# Altium schematic sheet CUBE+SCHEMATIC.schdoc
size 297 x 220 mm
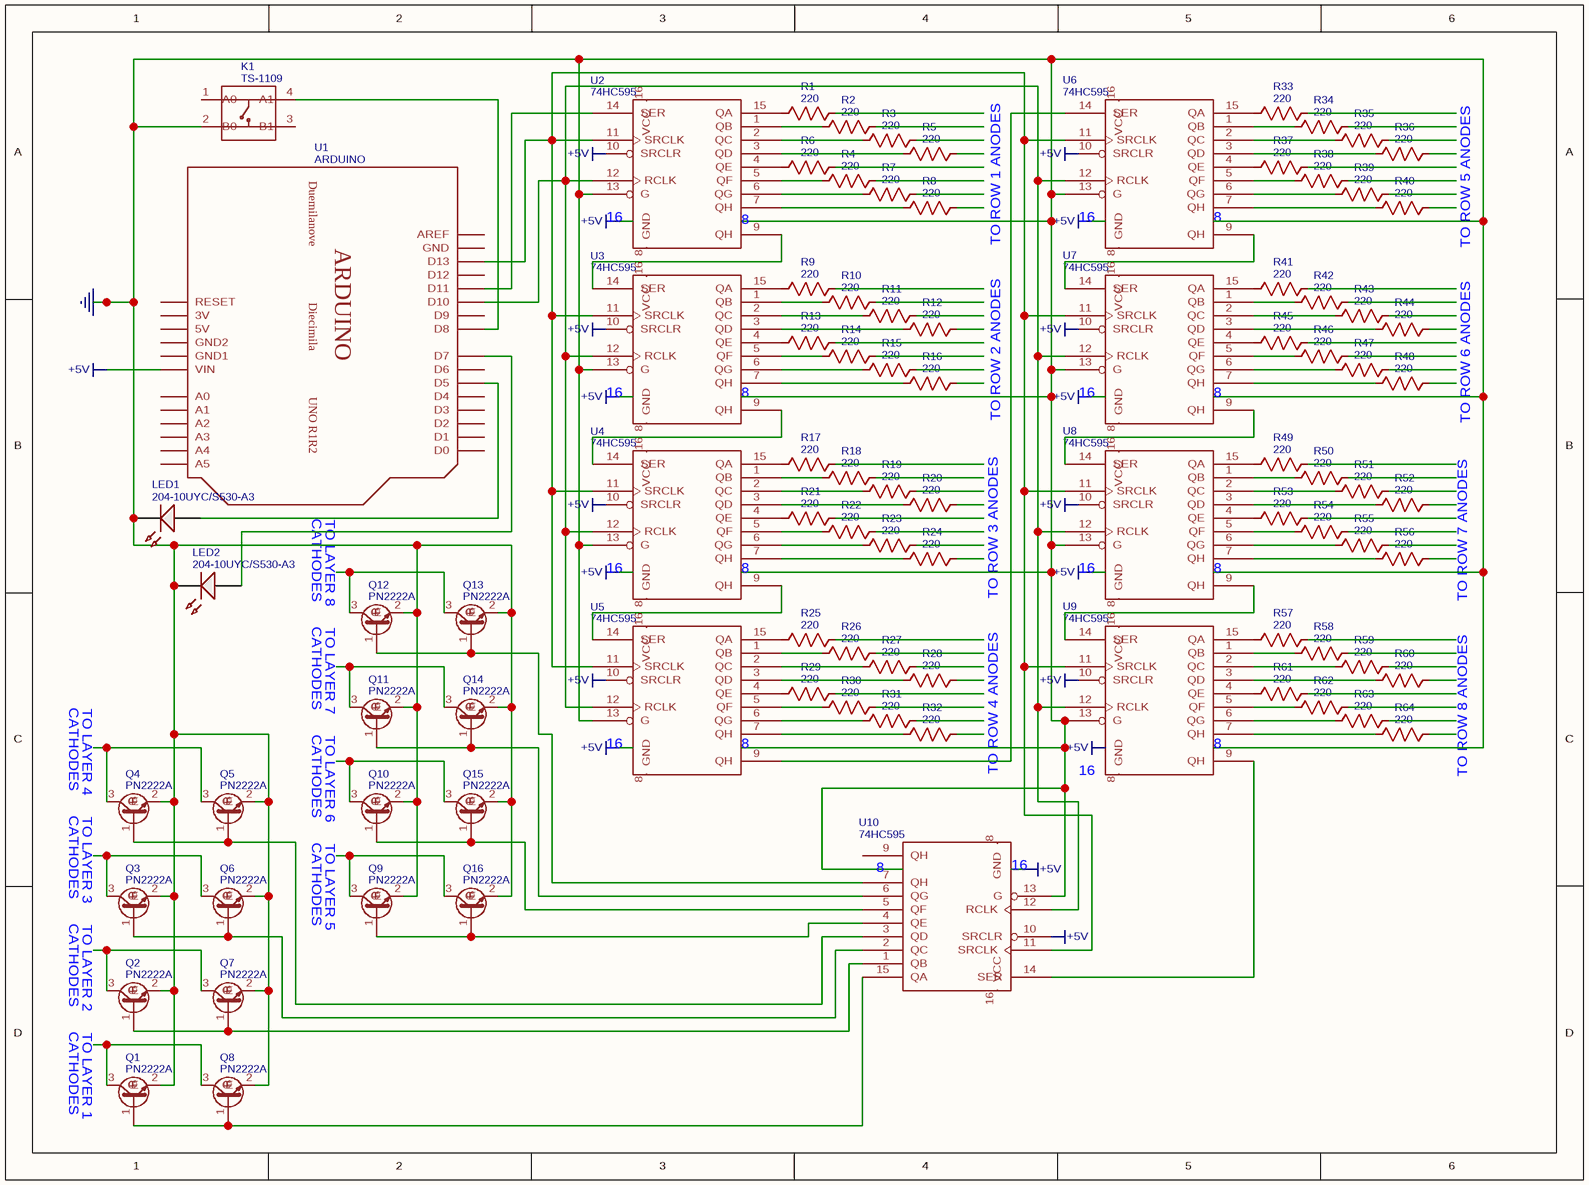
[diagram p0: CUBE+SCHEMATIC.schdoc]

## Parts
K1  value TS-1109  [SW4-6.0X6.0X5.0MM]
LED1  value 204-10UYC/S530-A3  [LED-3MM/2.54]
LED2  value 204-10UYC/S530-A3  [LED-3MM/2.54]
Q1  value PN2222A  [TO92]
Q2  value PN2222A  [TO92]
Q3  value PN2222A  [TO92]
Q4  value PN2222A  [TO92]
Q5  value PN2222A  [TO92]
Q6  value PN2222A  [TO92]
Q7  value PN2222A  [TO92]
Q8  value PN2222A  [TO92]
Q9  value PN2222A  [TO92]
Q10  value PN2222A  [TO92]
Q11  value PN2222A  [TO92]
Q12  value PN2222A  [TO92]
Q13  value PN2222A  [TO92]
Q14  value PN2222A  [TO92]
Q15  value PN2222A  [TO92]
Q16  value PN2222A  [TO92]
R1  value 220  [AXIAL-0.3]
R2  value 220  [AXIAL-0.3]
R3  value 220  [AXIAL-0.3]
R4  value 220  [AXIAL-0.3]
R5  value 220  [AXIAL-0.3]
R6  value 220  [AXIAL-0.3]
R7  value 220  [AXIAL-0.3]
R8  value 220  [AXIAL-0.3]
R9  value 220  [AXIAL-0.3]
R10  value 220  [AXIAL-0.3]
R11  value 220  [AXIAL-0.3]
R12  value 220  [AXIAL-0.3]
R13  value 220  [AXIAL-0.3]
R14  value 220  [AXIAL-0.3]
R15  value 220  [AXIAL-0.3]
R16  value 220  [AXIAL-0.3]
R17  value 220  [AXIAL-0.3]
R18  value 220  [AXIAL-0.3]
R19  value 220  [AXIAL-0.3]
R20  value 220  [AXIAL-0.3]
R21  value 220  [AXIAL-0.3]
R22  value 220  [AXIAL-0.3]
R23  value 220  [AXIAL-0.3]
R24  value 220  [AXIAL-0.3]
R25  value 220  [AXIAL-0.3]
R26  value 220  [AXIAL-0.3]
R27  value 220  [AXIAL-0.3]
R28  value 220  [AXIAL-0.3]
R29  value 220  [AXIAL-0.3]
R30  value 220  [AXIAL-0.3]
R31  value 220  [AXIAL-0.3]
R32  value 220  [AXIAL-0.3]
R33  value 220  [AXIAL-0.3]
R34  value 220  [AXIAL-0.3]
R35  value 220  [AXIAL-0.3]
R36  value 220  [AXIAL-0.3]
R37  value 220  [AXIAL-0.3]
R38  value 220  [AXIAL-0.3]
R39  value 220  [AXIAL-0.3]
R40  value 220  [AXIAL-0.3]
R41  value 220  [AXIAL-0.3]
R42  value 220  [AXIAL-0.3]
R43  value 220  [AXIAL-0.3]
R44  value 220  [AXIAL-0.3]
R45  value 220  [AXIAL-0.3]
R46  value 220  [AXIAL-0.3]
R47  value 220  [AXIAL-0.3]
R48  value 220  [AXIAL-0.3]
R49  value 220  [AXIAL-0.3]
R50  value 220  [AXIAL-0.3]
R51  value 220  [AXIAL-0.3]
R52  value 220  [AXIAL-0.3]
R53  value 220  [AXIAL-0.3]
R54  value 220  [AXIAL-0.3]
R55  value 220  [AXIAL-0.3]
R56  value 220  [AXIAL-0.3]
R57  value 220  [AXIAL-0.3]
R58  value 220  [AXIAL-0.3]
R59  value 220  [AXIAL-0.3]
R60  value 220  [AXIAL-0.3]
R61  value 220  [AXIAL-0.3]
R62  value 220  [AXIAL-0.3]
R63  value 220  [AXIAL-0.3]
R64  value 220  [AXIAL-0.3]
U1  value ARDUINO  [ARDUINO]
U2  value 74HC595  [NONE]
U3  value 74HC595  [NONE]
U4  value 74HC595  [NONE]
U5  value 74HC595  [NONE]
U6  value 74HC595  [NONE]
U7  value 74HC595  [NONE]
U8  value 74HC595  [NONE]
U9  value 74HC595  [NONE]
U10  value 74HC595  [NONE]

## Nets
+5V: U1.VIN U10.10(SRCLR)
GND: K1.2(B0) LED1.2(C) LED2.2(C) Q1.2(E) Q2.2(E) Q3.2(E) Q4.2(E) Q5.2(E) Q6.2(E) Q7.2(E) Q8.2(E) Q9.2(E) Q10.2(E) Q11.2(E) Q12.2(E) Q13.2(E) Q14.2(E) Q15.2(E) Q16.2(E) U2.13(G) U3.13(G) U4.13(G) U5.13(G) U6.13(G) U7.13(G) U8.13(G) U9.13(G) U10.13(G)
NetK1_4: K1.4(A1) U1.D8
NetLED1_1: LED1.1(A) U1.D5
NetLED2_1: LED2.1(A) U1.D7
NetQ1_1: Q1.1(B) Q8.1(B) U10.15(QA)
NetQ1_3: Q1.3(C) Q8.3(C)
NetQ2_1: Q2.1(B) Q7.1(B) U10.1(QB)
NetQ2_3: Q2.3(C) Q7.3(C)
NetQ3_1: Q3.1(B) Q6.1(B) U10.2(QC)
NetQ3_3: Q3.3(C) Q6.3(C)
NetQ4_1: Q4.1(B) Q5.1(B) U10.3(QD)
NetQ4_3: Q4.3(C) Q5.3(C)
NetQ9_1: Q9.1(B) Q16.1(B) U10.4(QE)
NetQ9_3: Q9.3(C) Q16.3(C)
NetQ10_1: Q10.1(B) Q15.1(B) U10.5(QF)
NetQ10_3: Q10.3(C) Q15.3(C)
NetQ11_1: Q11.1(B) Q14.1(B) U10.6(QG)
NetQ11_3: Q11.3(C) Q14.3(C)
NetQ12_1: Q12.1(B) Q13.1(B) U10.7(QH)
NetQ12_3: Q12.3(C) Q13.3(C)
NetR1_2: R1.2 U2.15(QA)
NetR2_2: R2.2 U2.1(QB)
NetR3_2: R3.2 U2.2(QC)
NetR4_2: R4.2 U2.5(QF)
NetR5_2: R5.2 U2.3(QD)
NetR6_2: R6.2 U2.4(QE)
NetR7_2: R7.2 U2.6(QG)
NetR8_2: R8.2 U2.7(QH)
NetR9_2: R9.2 U3.15(QA)
NetR10_2: R10.2 U3.1(QB)
NetR11_2: R11.2 U3.2(QC)
NetR12_2: R12.2 U3.3(QD)
NetR13_2: R13.2 U3.4(QE)
NetR14_2: R14.2 U3.5(QF)
NetR15_2: R15.2 U3.6(QG)
NetR16_2: R16.2 U3.7(QH)
NetR17_2: R17.2 U4.15(QA)
NetR18_2: R18.2 U4.1(QB)
NetR19_2: R19.2 U4.2(QC)
NetR20_2: R20.2 U4.3(QD)
NetR21_2: R21.2 U4.4(QE)
NetR22_2: R22.2 U4.5(QF)
NetR23_2: R23.2 U4.6(QG)
NetR24_2: R24.2 U4.7(QH)
NetR25_2: R25.2 U5.15(QA)
NetR26_2: R26.2 U5.1(QB)
NetR27_2: R27.2 U5.2(QC)
NetR28_2: R28.2 U5.3(QD)
NetR29_2: R29.2 U5.4(QE)
NetR30_2: R30.2 U5.5(QF)
NetR31_2: R31.2 U5.6(QG)
NetR32_2: R32.2 U5.7(QH)
NetR33_2: R33.2 U6.15(QA)
NetR34_2: R34.2 U6.1(QB)
NetR35_2: R35.2 U6.2(QC)
NetR36_2: R36.2 U6.3(QD)
NetR37_2: R37.2 U6.4(QE)
NetR38_2: R38.2 U6.5(QF)
NetR39_2: R39.2 U6.6(QG)
NetR40_2: R40.2 U6.7(QH)
NetR41_2: R41.2 U7.15(QA)
NetR42_2: R42.2 U7.1(QB)
NetR43_2: R43.2 U7.2(QC)
NetR44_2: R44.2 U7.3(QD)
NetR45_2: R45.2 U7.4(QE)
NetR46_2: R46.2 U7.5(QF)
NetR47_2: R47.2 U7.6(QG)
NetR48_2: R48.2 U7.7(QH)
NetR49_2: R49.2 U8.15(QA)
NetR50_2: R50.2 U8.1(QB)
NetR51_2: R51.2 U8.2(QC)
NetR52_2: R52.2 U8.3(QD)
NetR53_2: R53.2 U8.4(QE)
NetR54_2: R54.2 U8.5(QF)
NetR55_2: R55.2 U8.6(QG)
NetR56_2: R56.2 U8.7(QH)
NetR57_2: R57.2 U9.15(QA)
NetR58_2: R58.2 U9.1(QB)
NetR59_2: R59.2 U9.2(QC)
NetR60_2: R60.2 U9.3(QD)
NetR61_2: R61.2 U9.4(QE)
NetR62_2: R62.2 U9.5(QF)
NetR63_2: R63.2 U9.6(QG)
NetR64_2: R64.2 U9.7(QH)
NetU1_D10: U1.D10 U2.12(RCLK) U3.12(RCLK) U4.12(RCLK) U5.12(RCLK) U6.12(RCLK) U7.12(RCLK) U8.12(RCLK) U9.12(RCLK) U10.12(RCLK)
NetU1_D11: U1.D11 U2.14(SER)
NetU1_D13: U1.D13 U2.11(SRCLK) U3.11(SRCLK) U4.11(SRCLK) U5.11(SRCLK) U6.11(SRCLK) U7.11(SRCLK) U8.11(SRCLK) U9.11(SRCLK) U10.11(SRCLK)
NetU2_9: U2.9(QH) U3.14(SER)
NetU3_9: U3.9(QH) U4.14(SER)
NetU4_9: U4.9(QH) U5.14(SER)
NetU5_9: U5.9(QH) U6.14(SER)
NetU6_9: U6.9(QH) U7.14(SER)
NetU7_9: U7.9(QH) U8.14(SER)
NetU8_9: U8.9(QH) U9.14(SER)
NetU9_9: U9.9(QH) U10.14(SER)

Not connected (* = marked no-connect by the designer): K1 1(A0) 3(B1); R1 1; R2 1; R3 1; R4 1; R5 1; R6 1; R7 1; R8 1; R9 1; R10 1; R11 1; R12 1; R13 1; R14 1; R15 1; R16 1; R17 1; R18 1; R19 1; R20 1; R21 1; R22 1; R23 1; R24 1; R25 1; R26 1; R27 1; R28 1; R29 1; R30 1; R31 1; R32 1; R33 1; R34 1; R35 1; R36 1; R37 1; R38 1; R39 1; R40 1; R41 1; R42 1; R43 1; R44 1; R45 1; R46 1; R47 1; R48 1; R49 1; R50 1; R51 1; R52 1; R53 1; R54 1; R55 1; R56 1; R57 1; R58 1; R59 1; R60 1; R61 1; R62 1; R63 1; R64 1; U1 3V 5V A0 A1 A2 A3 A4 A5 AREF D0 D1 D2 D3 D4 D6 D9 D12 GND GND1 GND2 RESET; U2 8(GND) 10(SRCLR) 16(VCC); U3 8(GND) 10(SRCLR) 16(VCC); U4 8(GND) 10(SRCLR) 16(VCC); U5 8(GND) 10(SRCLR) 16(VCC); U6 8(GND) 10(SRCLR) 16(VCC); U7 8(GND) 10(SRCLR) 16(VCC); U8 8(GND) 10(SRCLR) 16(VCC); U9 8(GND) 10(SRCLR) 16(VCC); U10 8(GND) 9(QH) 16(VCC)

## Notes on the sheet
- (near U2) 16
- (near U2) 8
- TO ROW 1 ANODES
- (near U6) 16
- (near U6) 8
- TO ROW 5 ANODES
- (near U3) 16
- (near U3) 8
- (near U7) 16
- (near U7) 8
- TO ROW 2 ANODES
- TO ROW 6 ANODES
- CATHODES
- TO LAYER 8
- (near U4) 16
- (near U4) 8
- TO ROW 3 ANODES
- (near U8) 16
- (near U8) 8
- TO ROW 7 ANODES
- TO LAYER 7
- (near Q4) TO LAYER 4
- TO LAYER 6
- (near U5) 16
- (near U5) 8
- TO ROW 4 ANODES
- (near U9) 16
- (near U9) 8
- TO ROW 8 ANODES
- TO LAYER 3
- TO LAYER 5
- (near U10) 16
- TO LAYER 2
- (near U10) 8
- TO LAYER 1
- Labels drawn without touching a wire or pin: +5V
- (in symbol U1) Duemilanove; Diecimila; UNO R1R2

## Library data of the parts
K1 = (no symbol name): catid: 20; description: SWITCH TACTILE SPST-NO 0.05A 12V; BOM_Manufacturer Part: TS-1109; spicePre: K
LED1 LED2 = (no symbol name): BOM_Manufacturer: EVERLIGHT; BOM_LCSC: C73643; BOM_Supplier: LCSC; BOM_Manufacturer Part: 204-10UYC/S530-A3; spicePre: L
Q1-Q16 U2-U10 = (no symbol name): catid: 20; Contributor: KiCad; BOM_Manufacturer Part: ?
  Q1-Q16: spicePre: Q
  U2-U10: spicePre: U
R1-R64 = (no symbol name): nameAlias: Value(Ω); BOM_Manufacturer Part: ?; spicePre: R; spiceSymbolName: Resistor
U1 = (no symbol name): catid: 20; Contributor: Adafruit; BOM_Manufacturer Part: ?; spicePre: U